# Altium schematic sheet Schematics.SchDoc
size A; SheetNumber: 1; SheetTotal: 1
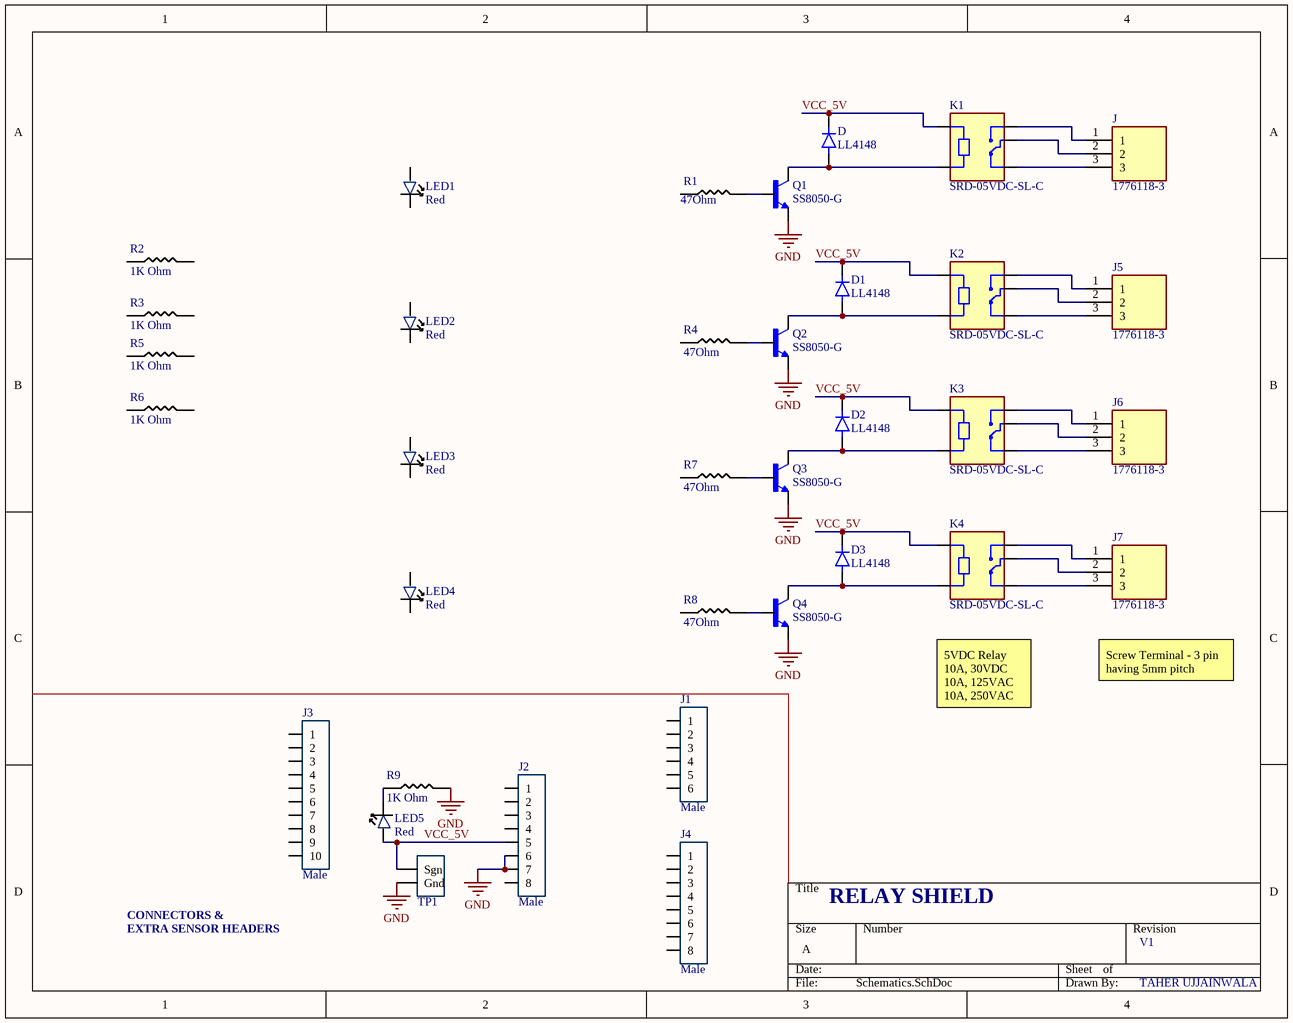
[diagram p0: Schematics.SchDoc]

## Parts
D  LL4148  [DIO_LL4148]
D1  LL4148  [DIO_LL4148]
D2  LL4148  [DIO_LL4148]
D3  LL4148  [DIO_LL4148]
J  1776118-3  [TE_1776118-3]
J1  value Male  [6_PIN_ARDUINO_100mil]  (hidden comment: PPTC061LFBN-RC)
J2  value Male  [8_PIN_ARDUINO_100MIL]  (hidden comment: PPTC081LFBN-RC)
J3  value Male  [10_PIN_ARDUINO_100MIL]  (hidden comment: PPTC101LFBN-RC)
J4  value Male  [8_PIN_ARDUINO_100MIL]  (hidden comment: PPTC081LFBN-RC)
J5  1776118-3  [TE_1776118-3]
J6  1776118-3  [TE_1776118-3]
J7  1776118-3  [TE_1776118-3]
K1  SRD-05VDC-SL-C  [RELAY_SRD-05VDC-SL-C]
K2  SRD-05VDC-SL-C  [RELAY_SRD-05VDC-SL-C]
K3  SRD-05VDC-SL-C  [RELAY_SRD-05VDC-SL-C]
K4  SRD-05VDC-SL-C  [RELAY_SRD-05VDC-SL-C]
LED1  value Red  [LED_0603]  (hidden comment: KT-0603R)
LED2  value Red  [LED_0603]  (hidden comment: KT-0603R)
LED3  value Red  [LED_0603]  (hidden comment: KT-0603R)
LED4  value Red  [LED_0603]  (hidden comment: KT-0603R)
LED5  value Red  [LED]  (hidden comment: LTST-C150CKT)
Q1  SS8050-G  [TRANS_SS8050-G]
Q2  SS8050-G  [TRANS_SS8050-G]
Q3  SS8050-G  [TRANS_SS8050-G]
Q4  SS8050-G  [TRANS_SS8050-G]
R1  value 47Ohm  [1206_Passive_Resitor]  (hidden comment: 47 Ohms)
R2  value 1K Ohm  [0402_Passive_Resistor]  (hidden comment: 1k)
R3  value 1K Ohm  [0402_Passive_Resistor]  (hidden comment: 1k)
R4  value 47Ohm  [1206_Passive_Resitor]  (hidden comment: 47 Ohms)
R5  value 1K Ohm  [0402_Passive_Resistor]  (hidden comment: 1k)
R6  value 1K Ohm  [0402_Passive_Resistor]  (hidden comment: 1k)
R7  value 47Ohm  [1206_Passive_Resitor]  (hidden comment: 47 Ohms)
R8  value 47Ohm  [1206_Passive_Resitor]  (hidden comment: 47 Ohms)
R9  value 1K Ohm  [1206_Passive_Resitor]  (hidden comment: 1k)
TP1  10x Probe TP  [TP10x_Probe]  (value not drawn)

## Nets
GND: J2.6 J2.7 Q1.2(E) Q2.2(E) Q3.2(E) Q4.2(E) R9.2 TP1.2(Gnd)
VCC_5V: D.C D1.C D2.C D3.C J2.5 K1.A1 K2.A1 K3.A1 K4.A1 LED5.2 TP1.1(Sgn)
NetD1_A: D1.A K2.A2 Q2.3(C)
NetD2_A: D2.A K3.A2 Q3.3(C)
NetD3_A: D3.A K4.A2 Q4.3(C)
NetD_A: D.A K1.A2 Q1.3(C)
NetJ5_1: J5.1 K2.NO
NetJ5_2: J5.2 K2.COM
NetJ5_3: J5.3 K2.NC
NetJ6_1: J6.1 K3.NO
NetJ6_2: J6.2 K3.COM
NetJ6_3: J6.3 K3.NC
NetJ7_1: J7.1 K4.NO
NetJ7_2: J7.2 K4.COM
NetJ7_3: J7.3 K4.NC
NetJ_1: J.1 K1.NO
NetJ_2: J.2 K1.COM
NetJ_3: J.3 K1.NC
NetLED5_1: LED5.1 R9.1
NetQ1_1: Q1.1(B) R1.2
NetQ2_1: Q2.1(B) R4.2
NetQ3_1: Q3.1(B) R7.2
NetQ4_1: Q4.1(B) R8.2

Not connected (* = marked no-connect by the designer): J1 1 2 3 4 5 6; J2 1 2 3 4 8; J3 1 2 3 4 5 6 7 8 9 10; J4 1 2 3 4 5 6 7 8; LED1 1 2; LED2 1 2; LED3 1 2; LED4 1 2; R1 1; R2 1 2; R3 1 2; R4 1; R5 1 2; R6 1 2; R7 1; R8 1

## Notes on the sheet
- 5VDC Relay
  10A, 30VDC
  10A, 125VAC
  10A, 250VAC
- Screw Terminal - 3 pin having 5mm pitch
- RELAY SHIELD
- CONNECTORS &
- EXTRA SENSOR HEADERS
- V1
- TAHER UJJAINWALA

## Library data of the parts
D D1-D3 = LL4148: Diode Standard 100V 200mA Surface Mount SOD-80; MF: ON Semiconductor; Package: SOD-80 Taitron; Availability: Unavailable; MP: LL4148; Value: *; SnapEDA_Link: https://www.snapeda.com/parts/LL4148/ON%20Semiconductor/view-part/2182678/?ref=snap; Price: None
J J5-J7 = 1776118-3: Conn Terminal Block F 3 POS 5mm Solder ST Thru-Hole Package; Number_of_Positions: 3; Centerline_Pitch: 5 mm[.197 in]; MF: TE Connectivity; Value: *; MP: 1776118-3; SnapEDA_Link: https://www.snapeda.com/parts/1776118-3/TE%20Connectivity%20AMP%20Connectors/view-part/2375684/?ref=snap; Availability: Unavailable; Package: None; TE_purchase_URL: https://www.te.com/usa-en/product-1776118-3.html?te_bu=Cor&te_type=disp&te_campaign=seda_glo_cor-seda-global-disp-prtnr-fy19-seda-model-bom-cta_sma-317_1&elqCampaignId=32493; Price: None; EU_RoHS_Compliance: Compliant with Exemptions
J1 = JM_6_PIN_MALE_ARDUINO: 6 Position Header Connector 0.100" (2.54mm) Through Hole Tin; Digikey Link: https://www.digikey.com/product-detail/en/PPTC061LFBN-RC/S7004-ND/810145/?itemSeq=304982353; Digikey Part: S7004-ND; LCSC Part#: DNP
J2 J4 = JM_8_PIN_MALE_ARDUINO: 8 Position Header Connector 0.100" (2.54mm) Through Hole Tin; Digikey Link: https://www.digikey.com/product-detail/en/PPTC081LFBN-RC/S7006-ND/810147/?itemSeq=304982354; Digikey Part: S7006-ND; LCSC Part#: DNP
J3 = JM_10_PIN_MALE_ARDUINO: 10 Position Header Connector 0.100" (2.54mm) Through Hole Tin; Digikey Link: https://www.digikey.com/product-detail/en/PPTC101LFBN-RC/S7008-ND/810149/?itemSeq=304982352; Digikey Part: S7008-ND; LCSC Part#: DNP
K1-K4 = SRD-05VDC-SL-C: 5V Trigger Relay Module For Arduino And Raspberry Pi 5V Trigger Relay Module For Arduino And Raspberry Pi; MF: Songle Relay; Package: None; Value: *; Availability: Not in stock; SnapEDA_Link: https://www.snapeda.com/parts/SRD-05VDC-SL-C/Songle+Relay/view-part/?ref=snap; Price: None; MP: SRD-05VDC-SL-C; Check_prices: https://www.snapeda.com/parts/SRD-05VDC-SL-C/Songle+Relay/view-part/?ref=eda
LED1-LED4 = LED_RED_0603: LIGHT EMITTING DIODES (LED) RED 520~625NM 90~100MCD@20MA TOP VIEW 0603 ROHS; Type: Basic; Datasheet: https://datasheet.lcsc.com/szlcsc/Everlight-Elec-19-217-BHC-ZL1M2RY-3T_C72041.pdf; MFR Part #: KT-0603R; LCSC Part#: C2286
LED5 = LED_1206: Red 638nm LED Indication - Discrete 1.8V 1206 (3216 Metric); Digikey Link: https://www.digikey.com/product-detail/en/LTST-C150CKT/160-1167-1-ND/269239/?itemSeq=304982368; Digikey Part: 160-1167-1-ND
Q1-Q4 = SS8050-G: Bipolar (BJT) Transistor NPN 25 V 1.5 A 100MHz 300 mW Surface Mount SOT-23-3; MF: Comchip Technology; SnapEDA_Link: https://www.snapeda.com/parts/SS8050-G/Comchip+Technology/view-part/?ref=snap; Purchase-URL: https://pricing.snapeda.com/search/part/SS8050-G/?ref=eda; Availability: In Stock; Price: None; Package: TO-236-3 Comchip Technology; Check_prices: https://www.snapeda.com/parts/SS8050-G/Comchip+Technology/view-part/?ref=eda; Value: *; MP: SS8050-G
R1 R4 R7 R8 = R_47Ohm_1206: 47Ω ±5% 0.25W ±200ppm/℃ 1206 Chip Resistor - Surface Mount RoHS; MFR Part #: 1206W4J0470T5E; LCSC Part#: C25384; Type: Extended; Datasheet: https://datasheet.lcsc.com/lcsc/1811101020_UNI-ROYAL-Uniroyal-Elec-1206W4J0470T5E_C25384.pdf
R2 R3 R5 R6 = R_1K_0402: 1 kOhms chip resistor SURFACE MOUNT 1KOHMS ±1% 1/16W 0402 ROHS; MFR Part #: 0402WGF1001TCE; Datasheet: https://datasheet.lcsc.com/szlcsc/Uniroyal-Elec-0402WGF1001TCE_C11702.pdf; LCSC Part#: C11702; Type: Basic
R9 = R_1K_1206: 1 kOhms ±1% 0.5W, 1/2W Chip Resistor 1206 (3216 Metric) Anti-Sulfur, Moisture Resistant Thin Film; MFR Part #: 1206W4F1001T5; Digikey Link: https://www.digikey.com/product-detail/en/RNCP1206FTD1K00/RNCP1206FTD1K00CT-ND/2240675/?itemSeq=304982373; Digikey Part: RNCP1206FTD1K00CT-ND
TP1 = TP_10x_Probe: Test Point 300 mil centers